# EasyEDA Pro project mousring.epro

# Schematic Schematic1
Board Name: Board1; Create Date: 2025-04-29; Page Name: P1; Project Name: mousering; Schematic Name: Schematic1; Update Date: 2025-05-12; Company: EasyEDA.com; Page Size: A4; Version: V1.0
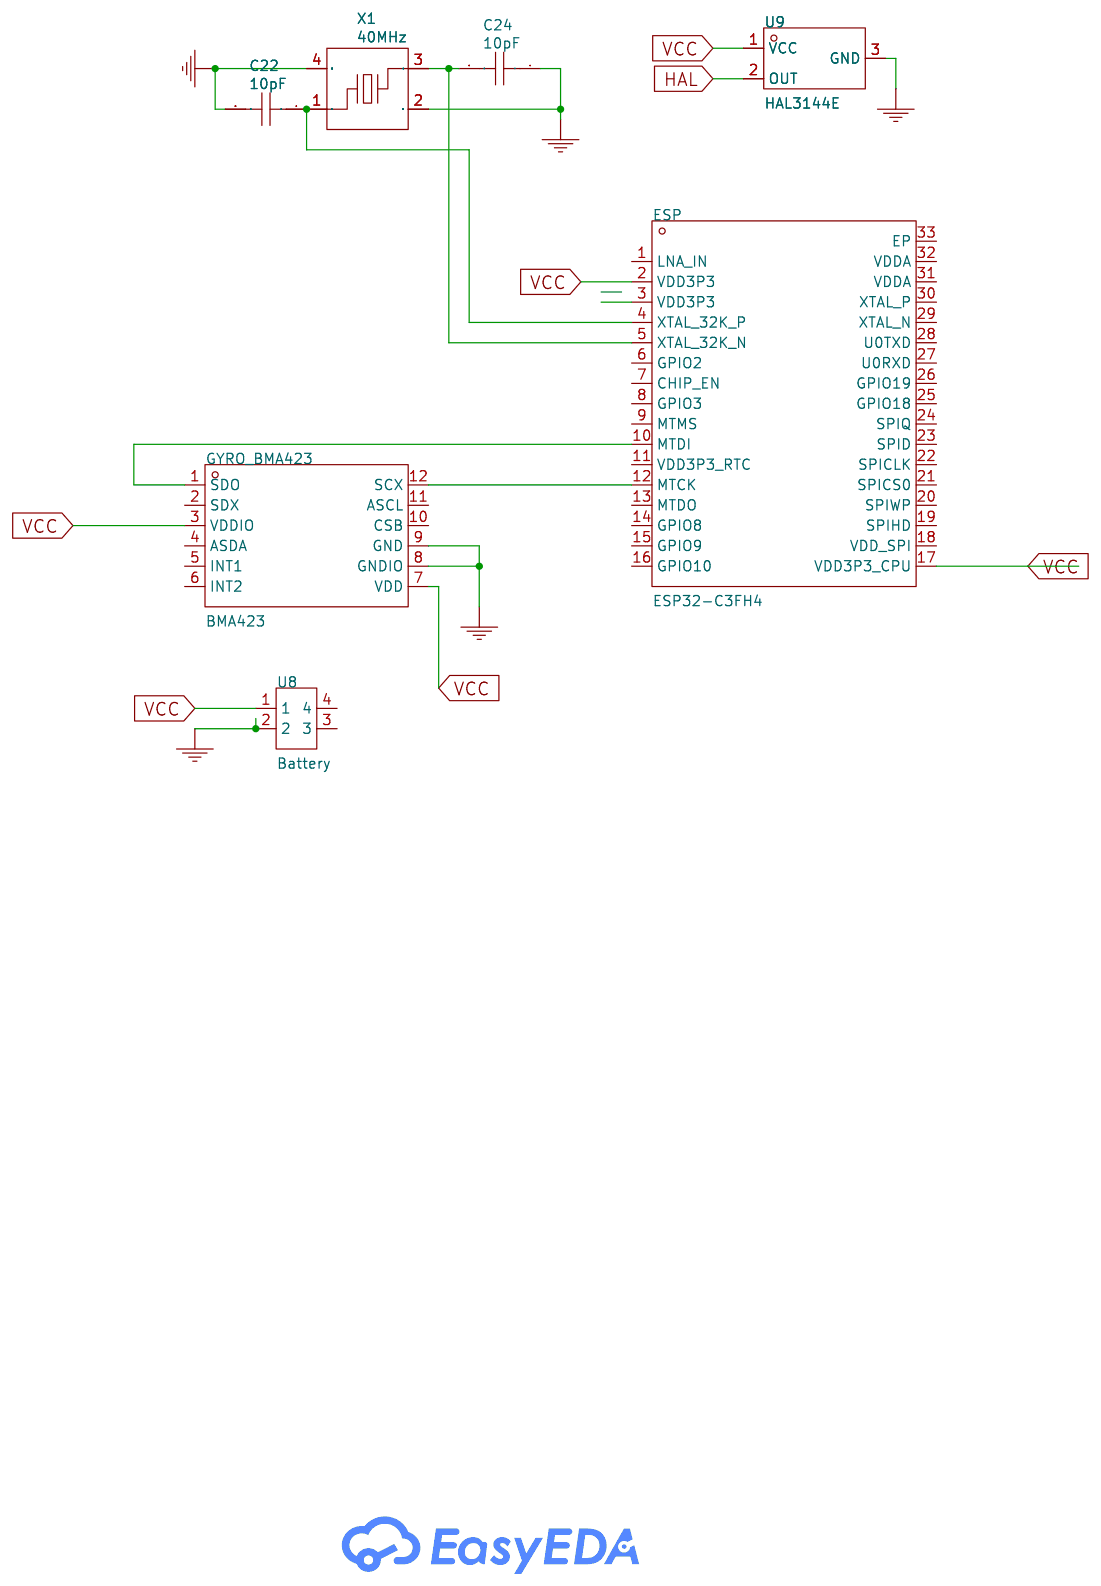
[diagram p0: schematic sheet]

## Parts
C22  10pF  [C0402]
C24  10pF  [C0402]
ESP  ESP32-C3FH4  [QFN-32_L5.0-W5.0-P0.50-TL-EP3.7]
GYRO_BMA423  BMA423  [LGA-12_L2.0-W2.0-P0.50-BL]
U8  Battery  [CONN-SMD_2.0-2PWT]
U9  HAL3144E  [SOT-23-3_L2.9-W1.6-P1.90-LS2.9-BL]
X1  40MHz  [CRYSTAL-SMD_4P-L1.6-W1.2-BL]

## Library data of the parts
C22 C24 = 10pF: Supplier: LCSC; Manufacturer: SAMSUNG(三星); Manufacturer Part: CL05C100JB5NNNC; Supplier Part: C32949; JLCPCB Part Class: Basic Part; link: https://lcsc.com/eda_search?q=C32949&%26type=1&ref=editor; nameAlias: Value; spicePre: C; spiceSymbolName: CL05C100JB5NNNC
ESP = ESP32-C3FH4: Supplier Part: C2858491; Manufacturer: ESPRESSIF(乐鑫); Supplier Footprint: QFN-32-EP(5x5); JLCPCB Part Class: Extended Part; Datasheet: https://atta.szlcsc.com/upload/public/pdf/source/20241030/9E2CC81EADAF965BF8A3CB78FAC4244F.pdf; Supplier: LCSC
GYRO_BMA423 = BMA423: Supplier Part: C189517; Manufacturer: Bosch(博世); Supplier Footprint: LGA-12(2x2); JLCPCB Part Class: Extended Part; Datasheet: https://atta.szlcsc.com/upload/public/pdf/source/20180628/C189517_D4E5A05318518518FDA0E175D3C2B3DB.pdf; Supplier: LCSC
U8 = Battery: Supplier Part: C9900011133; JLCPCB Part Class: Extended Part; Supplier: LCSC
U9 = HAL3144E: Voltage - Supply:3.8V~40V Voltage - Supply:3.8V~40V Operation Points:160Gs Operation Points:160Gs Release Points:40Gs Release Points:40Gs Operating Temperature:-40℃~+150℃ Operating Temperature:-40℃~+150℃; Supplier Part: C2843419; Manufacturer: Hallwee(霍尔微电子); Supplier Footprint: SOT-23; JLCPCB Part Class: Extended Part; Datasheet: https://atta.szlcsc.com/upload/public/pdf/source/20230614/A78D6DD088F58E7DA53C0C3D5890D47D.pdf; Supplier: LCSC; Voltage - Supply: 3.8V~40V; Operation Points: 160Gs; Release Points: 40Gs; Operating Temperature: -40℃~+150℃
X1 = 40MHz: Supplier: LCSC; Supplier Part: C7301927; Manufacturer: SCTF(星通时频); Manufacturer Part: SX0B40.000F1010F30; JLCPCB Part Class: Extended Part; nameAlias: Value; Contributor: lcsc; spicePre: X; spiceSymbolName: SX0B40.000F1010F30

## Nets
GND: C22.2 C24.1 GYRO_BMA423.8(GNDIO) GYRO_BMA423.9(GND) U8.2 U9.3(GND) X1.2(GND) X1.4(GND)
VCC: ESP.2(VDD3P3) ESP.17(VDD3P3_CPU) GYRO_BMA423.3(VDDIO) GYRO_BMA423.7(VDD) U8.1 U9.1(VCC)
HAL: U9.2(OUT)
$1N3840: ESP.10(MTDI) GYRO_BMA423.1(SDO)
$1N3967: C24.2 ESP.5(XTAL_32K_N) X1.3
$1N3968: C22.1 ESP.4(XTAL_32K_P) X1.1
$1N4537: ESP.12(MTCK) GYRO_BMA423.12(SCX)

Not connected (* = marked no-connect by the designer): ESP 1(LNA_IN) 3(VDD3P3) 6(GPIO2) 7(CHIP_EN) 8(GPIO3) 9(MTMS) 11(VDD3P3_RTC) 13(MTDO) 14(GPIO8) 15(GPIO9) 16(GPIO10) 18(VDD_SPI) 19(SPIHD) 20(SPIWP) 21(SPICS0) 22(SPICLK) 23(SPID) 24(SPIQ) 25(GPIO18) 26(GPIO19) 27(U0RXD) 28(U0TXD) 29(XTAL_N) 30(XTAL_P) 31(VDDA) 32(VDDA) 33(EP); GYRO_BMA423 2(SDX) 4(ASDA) 5(INT1) 6(INT2) 10(CSB) 11(ASCL); U8 3 4

# Schematic Schematic1_1
Board Name: Board1; Create Date: 2025-04-29; Page Name: P1; Project Name: mousering; Schematic Name: Schematic1; Update Date: 2025-05-12; Company: EasyEDA.com; Page Size: A4; Version: V1.0
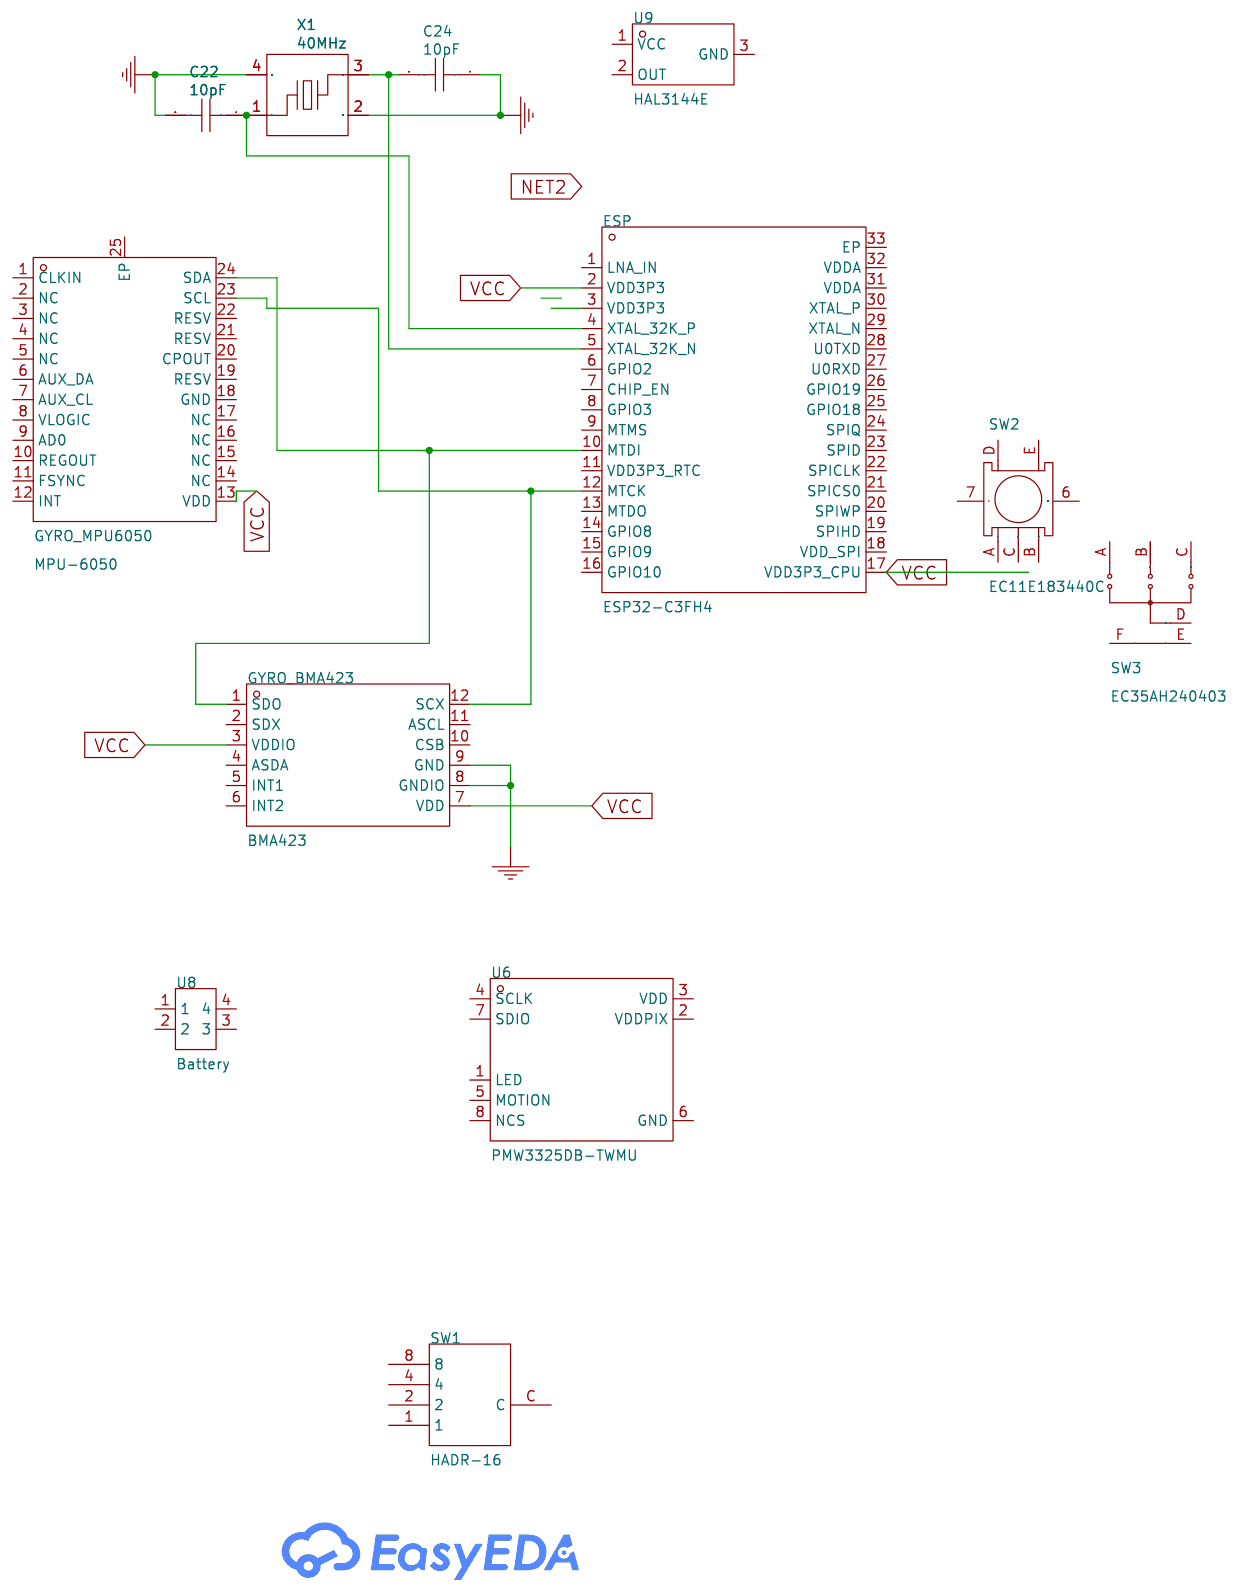
[diagram p1: schematic sheet]

## Parts
C22  10pF  [C0402]
C24  10pF  [C0402]
ESP  ESP32-C3FH4  [QFN-32_L5.0-W5.0-P0.50-TL-EP3.7]
GYRO_BMA423  BMA423  [LGA-12_L2.0-W2.0-P0.50-BL]
GYRO_MPU6050  MPU-6050  [QFN-24_L4.0-W4.0-P0.50-BL-EP2.7]
SW1  HADR-16  [SW-TH_5P-L10.0-W10.0-P2.54-LS7.6_HADR-16]
SW2  EC11E183440C  [SW-TH_EC11XXXXXXXX]
SW3  EC35AH240403  [SW-TH_EC35AH240403]
U6  PMW3325DB-TWMU  [SENSOR-TH_PAW3311DB-T2MU]
U8  Battery  [CONN-SMD_2.0-2PWT]
U9  HAL3144E  [SOT-23-3_L2.9-W1.6-P1.90-LS2.9-BL]
X1  40MHz  [CRYSTAL-SMD_4P-L1.6-W1.2-BL]

## Library data of the parts
C22 C24 = 10pF: Supplier: LCSC; Manufacturer: SAMSUNG(三星); Manufacturer Part: CL05C100JB5NNNC; Supplier Part: C32949; JLCPCB Part Class: Basic Part; link: https://lcsc.com/eda_search?q=C32949&%26type=1&ref=editor; nameAlias: Value; spicePre: C; spiceSymbolName: CL05C100JB5NNNC
ESP = ESP32-C3FH4: Supplier Part: C2858491; Manufacturer: ESPRESSIF(乐鑫); Supplier Footprint: QFN-32-EP(5x5); JLCPCB Part Class: Extended Part; Datasheet: https://atta.szlcsc.com/upload/public/pdf/source/20241030/9E2CC81EADAF965BF8A3CB78FAC4244F.pdf; Supplier: LCSC
GYRO_BMA423 = BMA423: Supplier Part: C189517; Manufacturer: Bosch(博世); Supplier Footprint: LGA-12(2x2); JLCPCB Part Class: Extended Part; Datasheet: https://atta.szlcsc.com/upload/public/pdf/source/20180628/C189517_D4E5A05318518518FDA0E175D3C2B3DB.pdf; Supplier: LCSC
GYRO_MPU6050 = MPU-6050: Sensor Type:加速度计陀螺仪 Operating Temperature:-40℃~+85℃ Operating Temperature:-40℃~+85℃; Supplier Part: C24112; Manufacturer: TDK InvenSense(应美盛); Supplier Footprint: QFN-24-EP(4x4); JLCPCB Part Class: Extended Part; Datasheet: https://atta.szlcsc.com/upload/public/pdf/source/20140425/1457707046159.pdf; Supplier: LCSC; Sensor Type: 加速度计陀螺仪; Operating Temperature: -40℃~+85℃
SW1 = HADR-16: LCSC Part Name: H系列 微型旋转编码开关 HADR-16; Supplier Part: C411262; Manufacturer: SUNGMUN(韩国星炆电子); JLCPCB Part Class: Extended Part; Datasheet: https://atta.szlcsc.com/upload/public/pdf/source/20190821/C411262_A0B46B5A71187555B76338994588A046.pdf; Supplier: LCSC
SW2 = EC11E183440C: LCSC Part Name: 编码器; Supplier Part: C370986; Manufacturer: ALPSALPINE(阿尔卑斯阿尔派); Supplier Footprint: 插件; JLCPCB Part Class: Extended Part; Datasheet: https://atta.szlcsc.com/upload/public/pdf/source/20190222/C370986_C8C40795CB70D1F06B68DAB6923041B4.pdf; Supplier: LCSC
SW3 = EC35AH240403: Supplier Part: C351240; Manufacturer: ALPSALPINE(阿尔卑斯阿尔派); Supplier Footprint: 插件; JLCPCB Part Class: Extended Part; Datasheet: https://atta.szlcsc.com/upload/public/pdf/source/20190114/C351240_CA77CA1636DCFF63B796F1B8F54D559C.pdf; Supplier: LCSC
U6 = PMW3325DB-TWMU: Supplier Part: C9900148276; Supplier Footprint: DIP; Supplier: LCSC
U8 = Battery: Supplier Part: C9900011133; JLCPCB Part Class: Extended Part; Supplier: LCSC
U9 = HAL3144E: Voltage - Supply:3.8V~40V Voltage - Supply:3.8V~40V Operation Points:160Gs Operation Points:160Gs Release Points:40Gs Release Points:40Gs Operating Temperature:-40℃~+150℃ Operating Temperature:-40℃~+150℃; Supplier Part: C2843419; Manufacturer: Hallwee(霍尔微电子); Supplier Footprint: SOT-23; JLCPCB Part Class: Extended Part; Datasheet: https://atta.szlcsc.com/upload/public/pdf/source/20230614/A78D6DD088F58E7DA53C0C3D5890D47D.pdf; Supplier: LCSC; Voltage - Supply: 3.8V~40V; Operation Points: 160Gs; Release Points: 40Gs; Operating Temperature: -40℃~+150℃
X1 = 40MHz: Supplier: LCSC; Supplier Part: C7301927; Manufacturer: SCTF(星通时频); Manufacturer Part: SX0B40.000F1010F30; JLCPCB Part Class: Extended Part; nameAlias: Value; Contributor: lcsc; spicePre: X; spiceSymbolName: SX0B40.000F1010F30

## Nets
GND: C22.2 C24.1 GYRO_BMA423.8(GNDIO) GYRO_BMA423.9(GND) X1.2(GND) X1.4(GND)
VCC: ESP.2(VDD3P3) ESP.17(VDD3P3_CPU) GYRO_BMA423.3(VDDIO) GYRO_BMA423.7(VDD) GYRO_MPU6050.13(VDD)
$1N3830: ESP.12(MTCK) GYRO_BMA423.12(SCX) GYRO_MPU6050.23(SCL)
$1N3840: ESP.10(MTDI) GYRO_BMA423.1(SDO) GYRO_MPU6050.24(SDA)
$1N3967: C24.2 ESP.5(XTAL_32K_N) X1.3
$1N3968: C22.1 ESP.4(XTAL_32K_P) X1.1

Not connected (* = marked no-connect by the designer): ESP 1(LNA_IN) 3(VDD3P3) 6(GPIO2) 7(CHIP_EN) 8(GPIO3) 9(MTMS) 11(VDD3P3_RTC) 13(MTDO) 14(GPIO8) 15(GPIO9) 16(GPIO10) 18(VDD_SPI) 19(SPIHD) 20(SPIWP) 21(SPICS0) 22(SPICLK) 23(SPID) 24(SPIQ) 25(GPIO18) 26(GPIO19) 27(U0RXD) 28(U0TXD) 29(XTAL_N) 30(XTAL_P) 31(VDDA) 32(VDDA) 33(EP); GYRO_BMA423 2(SDX) 4(ASDA) 5(INT1) 6(INT2) 10(CSB) 11(ASCL); GYRO_MPU6050 1(CLKIN) 2(NC) 3(NC) 4(NC) 5(NC) 6(AUX_DA) 7(AUX_CL) 8(VLOGIC) 9(AD0) 10(REGOUT) 11(FSYNC) 12(INT) 14(NC) 15(NC) 16(NC) 17(NC) 18(GND) 19(RESV) 20(CPOUT) 21(RESV) 22(RESV) 25(EP); SW1 1 2 4 8 C; SW2 6 7 A B C D E; SW3 A B C D E F; U6 1(LED) 2(VDDPIX) 3(VDD) 4(SCLK) 5(MOTION) 6(GND) 7(SDIO) 8(NCS); U8 1 2 3 4; U9 1(VCC) 2(OUT) 3(GND)

# Board PCB1
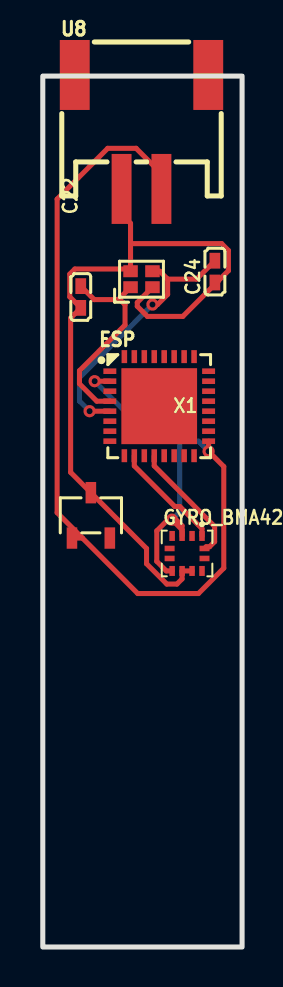
[diagram p2: board, top side]
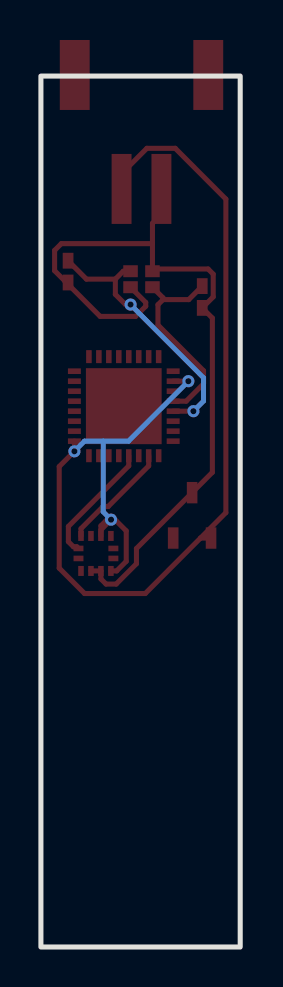
[diagram p3: board, bottom side, seen from below]

Outline 10 x 43.56 mm; copper layers: Top Layer, Bottom Layer. Coordinates in mm from the lower left corner of the outline.
Outline path: rectangle 0,43.56 10,0
Stack: Top Layer 0.035mm / Dielectric1 1.51mm FR4 er 4.5 / Bottom Layer 0.035mm

## Design rules (mm)
template: JLCPCB Capability(Two Layers Board)
spacing copperThickness1oz (default): track to track 0.102, other pairs 0.152 to 0.3
spacing copperThickness2oz: track to track 0.203, other pairs 0.152 to 0.3
track width copperThickness1oz (default): min 0.127, default 0.254, max 2.54
track width copperThickness2oz: min 0.203, default 0.254, max 2.54
differential pair differentialPair (default): width min 0.127, default 0.254, max 2.54; gap min 0.152, default 0.152
via viaSize (default): diameter min 0.5, default 0.61, max 10; hole min 0.3, default 0.305, max 6.3

## Placement (name value [footprint] x y rotation side)
C22  10pF  [C0402]  1.91 32.51 270 top
C24  10pF  [C0402]  8.64 33.78 90 top
ESP  ESP32-C3FH4  [QFN-32_L5.0-W5.0-P0.50-TL-EP3.7]  5.84 27.05 0 top
GYRO_BMA423  BMA423  [LGA-12_L2.0-W2.0-P0.50-BL]  7.24 19.69 180 top
U8  Battery  [CONN-SMD_2.0-2PWT]  4.95 40.77 0 top
U9  HAL3144E  [SOT-23-3_L2.9-W1.6-P1.90-LS2.9-BL]  2.41 21.59 0 top
X1  40MHz  [CRYSTAL-SMD_4P-L1.6-W1.2-BL]  4.95 33.4 0 top

## Footprints (pads in the part's own frame, mm; a bottom-side part is the same pattern mirrored in y, then rotated)
C0402
  rect 0.79x0.54 smd: 1(-0.545,0) 2(0.545,0)
CONN-SMD_2.0-2PWT
  rect 1x3.5 smd: 1(1,-2.85) 2(-1,-2.85)
  rect 1.5x3.5 smd: 3(3.35,2.85) 4(-3.35,2.85)
CRYSTAL-SMD_4P-L1.6-W1.2-BL
  rect 0.73x0.6 smd: 1(-0.55,-0.4) 2(0.55,-0.4) 3(0.55,0.4) 4(-0.55,0.4)
LGA-12_L2.0-W2.0-P0.50-BL
  rect 0.28x0.5 smd: 1(-0.75,-0.875) 2(-0.25,-0.875) 3(0.25,-0.875) 4(0.75,-0.875) 7(0.75,0.875) 8(0.25,0.875) 9(-0.25,0.875) 10(-0.75,0.875)
  rect 0.5x0.28 smd: 5(0.875,-0.25) 6(0.875,0.25) 11(-0.875,0.25) 12(-0.875,-0.25)
QFN-32_L5.0-W5.0-P0.50-TL-EP3.7
  rect 0.65x0.28 smd: 1(-2.478,1.75) 2(-2.478,1.25) 3(-2.478,0.75) 4(-2.478,0.25) 5(-2.478,-0.25) 6(-2.478,-0.75) 7(-2.478,-1.25) 8(-2.478,-1.75) 17(2.478,-1.75) 18(2.478,-1.25) 19(2.478,-0.75) 20(2.478,-0.25) 21(2.478,0.25) 22(2.478,0.75) 23(2.478,1.25) 24(2.478,1.75)
  rect 0.28x0.65 smd: 9(-1.75,-2.478) 10(-1.25,-2.478) 11(-0.75,-2.478) 12(-0.25,-2.478) 13(0.25,-2.478) 14(0.75,-2.478) 15(1.25,-2.478) 16(1.75,-2.478) 25(1.75,2.478) 26(1.25,2.478) 27(0.75,2.478) 28(0.25,2.478) 29(-0.25,2.478) 30(-0.75,2.478) 31(-1.25,2.478) 32(-1.75,2.478)
  rect 3.8x3.8 smd: 33(0,0)
SOT-23-3_L2.9-W1.6-P1.90-LS2.9-BL
  rect 0.532x1.07 smd: 1(-0.95,-1.135) 2(0.95,-1.135) 3(0,1.135)

## Nets
As in the schematic.

Pads without a net: ESP 1 6 7 8 9 11 13 14 15 16 18 19 20 21 22 23 24 25 26 27 28 29 30 31 32 33; GYRO_BMA423 2 4 5 6 10 11; U8 3 4

## Via types
v1: diameter 0.61, hole 0.305, Top Layer to Bottom Layer, 5 vias

## Routing (per net, layer and track width the routed paths; a pad name or vN(x,y) marks a point on that pad's centre or on a via; arc(x,y) is an arc through that point)
GND: length 40.4
  Top Layer w0.254: 4.4,35.18 4.4,36.2 3.95,36.65 U8.2 ; 4.4,35.18 4.4,33.91 ; 4.4,35.18 8.97,35.18 9.31,34.84 9.31,33.83 8.81,33.32 ; 4.4,33.91 X1.4 ; 4.4,33.91 1.61,33.91 1.35,33.66 1.35,32.52 C22.2 1.4,31.46 1.4,23.74 U9.3 5.21,19.93 5.21,19.17 6.22,18.15 6.73,18.15 6.99,18.41 GYRO_BMA423.8 GYRO_BMA423.9 ; C24.1 8.72,33.32 8.81,33.32 ; 8.81,33.32 7.03,31.54 5.25,31.54 4.74,32.05 4.74,32.24 X1.2
VCC: length 58.3
  Top Layer w0.254: 1.99,20.46 4.76,17.68 7.81,17.68 9.08,18.95 9.08,24.03 v1(8.32,24.79) ESP.17 ; 1.99,20.46 U9.1 ; 1.99,20.46 0.72,21.73 0.72,37.41 3.26,39.95 4.68,39.95 5.95,38.68 U8.1 ; 6.53,21.32 6.23,21.32 5.72,20.81 5.72,19.29 6.2,18.81 GYRO_BMA423.7 ; 6.53,21.32 v1(6.48,21.37) ; 6.53,21.32 6.74,21.32 6.99,21.07 6.99,20.87 ; 6.53,21.32 6.99,20.87 ; 6.99,20.87 GYRO_BMA423.3 ; ESP.2 v1(2.6,28.3)
  Bottom Layer w0.254: v1(8.32,24.79) 7.81,25.3 6.87,25.3 ; v1(6.48,21.37) 6.87,21.77 6.87,25.3 ; 6.87,25.3 5.6,25.3 v1(2.6,28.3)
$1N3840: length 5.6
  Top Layer w0.254: ESP.10 4.59,24.07 6.62,22.03 6.88,22.03 7.99,20.92 GYRO_BMA423.1
$1N3967: length 13.5
  Top Layer w0.254: C24.2 7.71,33.41 6.26,33.41 ; 6.26,33.41 6.26,32.64 5.76,32.14 v1(5.5,32.14) ; 6.26,33.41 5.87,33.8 X1.3 ; ESP.5 v1(2.35,26.8)
  Bottom Layer w0.254: v1(5.5,32.14) 1.84,28.47 1.84,27.31 v1(2.35,26.8)
$1N3968: length 10.2
  Top Layer w0.254: 3.87,32.38 4.13,32.13 4.13,31.11 1.84,28.83 1.84,28.17 2.71,27.3 ESP.4 ; 3.87,32.38 3.87,32.47 X1.1 ; 3.87,32.38 2.58,32.38 C22.1
$1N4537: length 6.2
  Top Layer w0.254: GYRO_BMA423.12 8.2,20.02 8.37,20.02 8.62,20.27 8.62,21.04 5.59,24.07 ESP.12

# Board PCB1_1
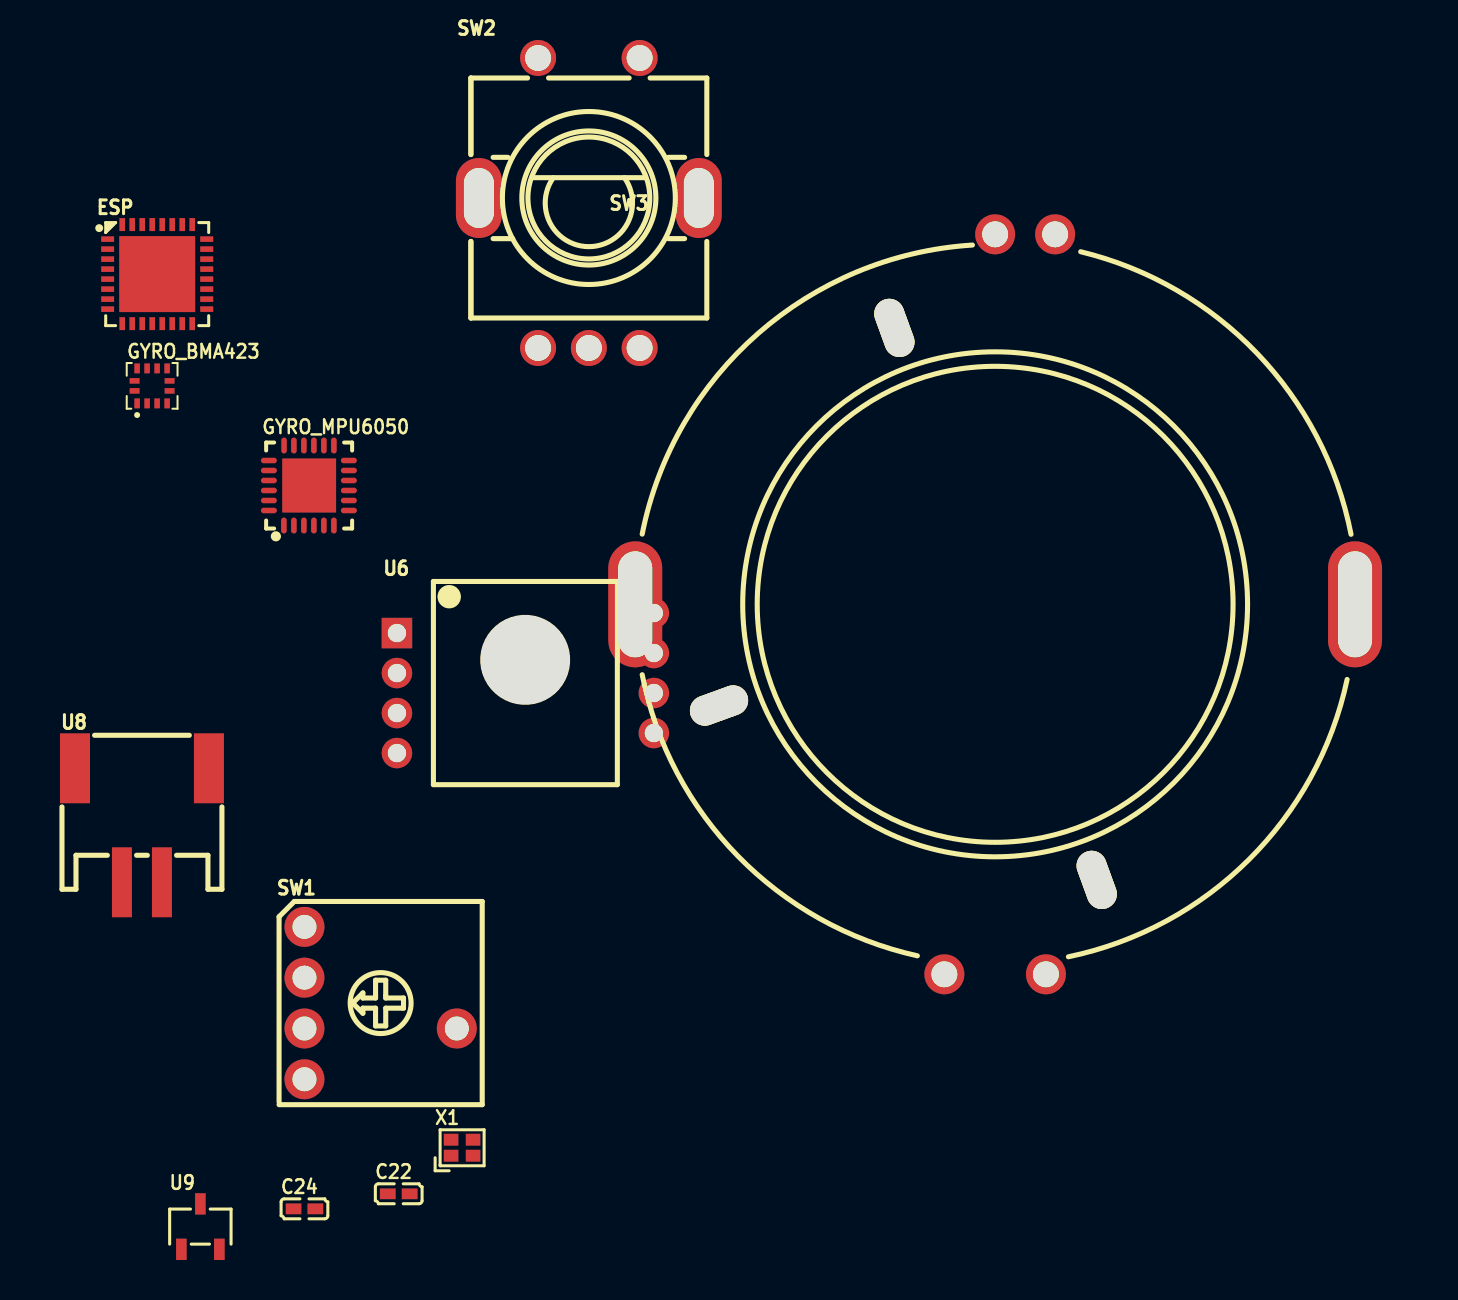
[diagram p4: board, top side]
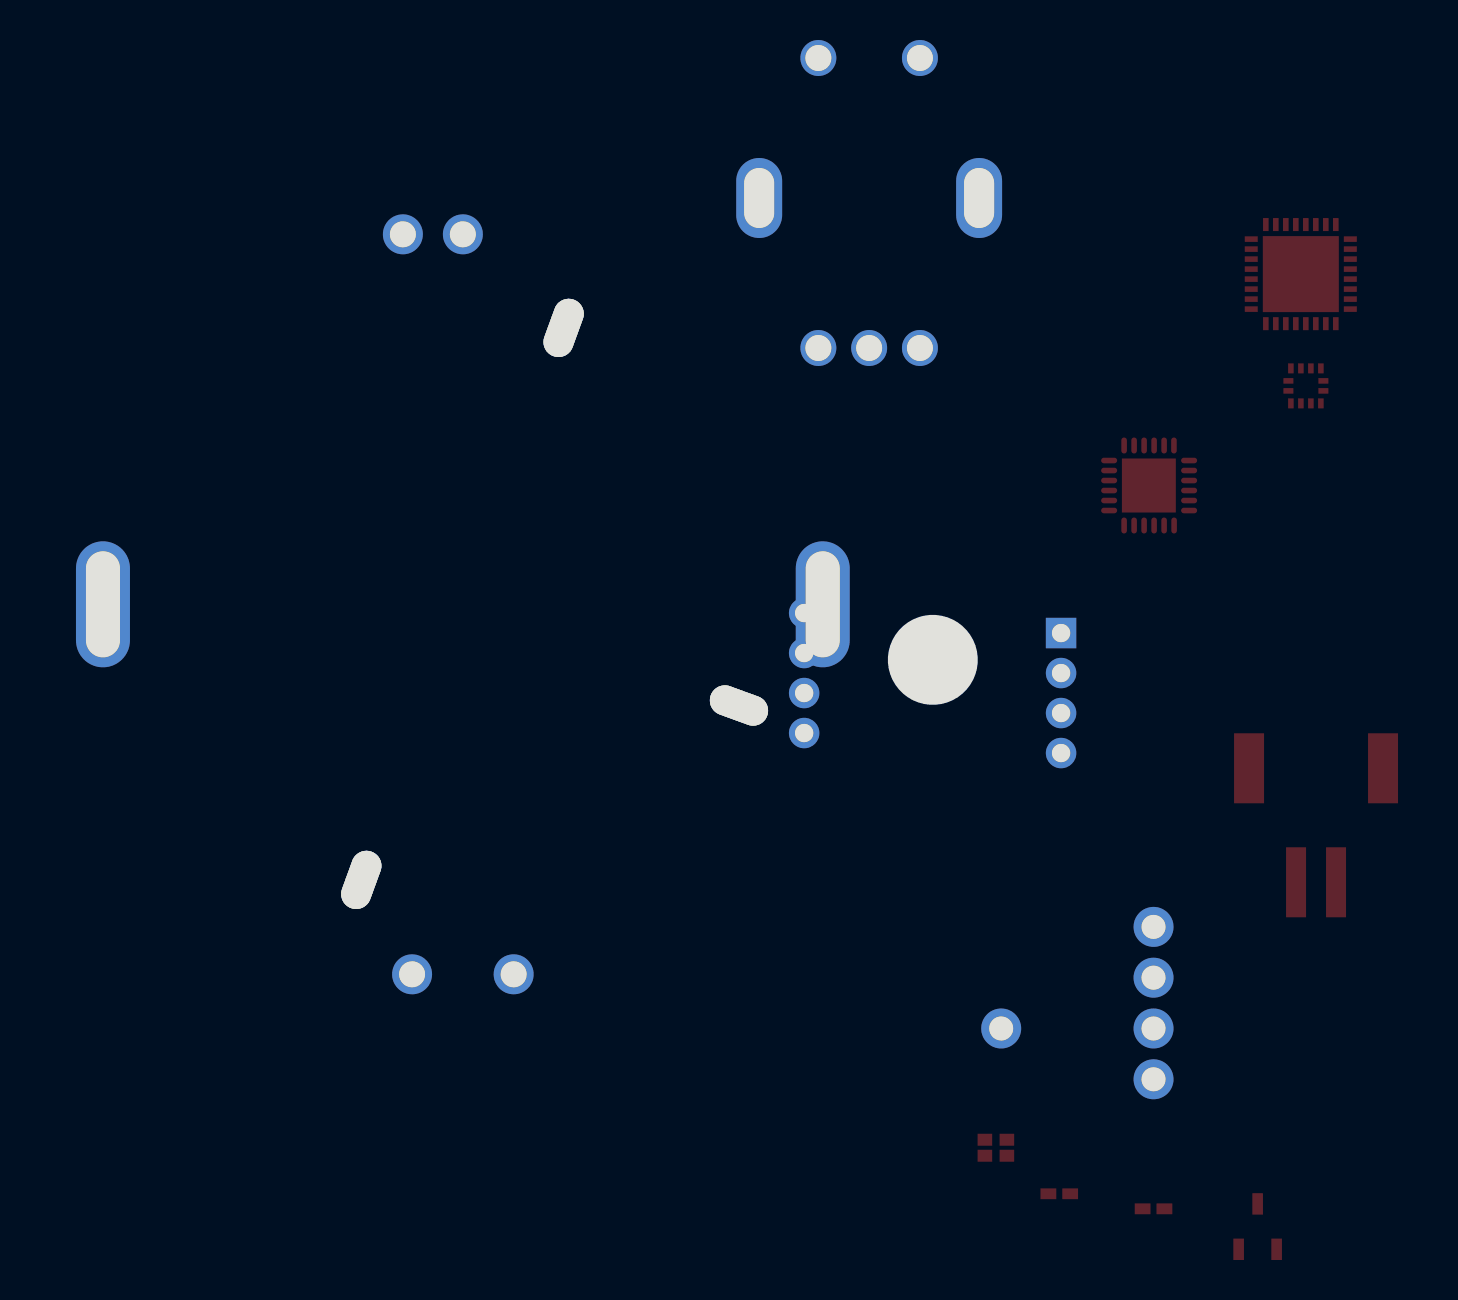
[diagram p5: board, bottom side, seen from below]

Outline 4.49 x 4.49 mm; copper layers: Top Layer, Bottom Layer. Coordinates in mm from the lower left corner of the outline.
Stack: Top Layer 0.035mm / Dielectric1 1.51mm FR4 er 4.5 / Bottom Layer 0.035mm

## Design rules (mm)
template: JLCPCB Capability(Two Layers Board)
spacing copperThickness1oz (default): track to track 0.102, other pairs 0.152 to 0.3
spacing copperThickness2oz: track to track 0.203, other pairs 0.152 to 0.3
track width copperThickness1oz (default): min 0.127, default 0.254, max 2.54
track width copperThickness2oz: min 0.203, default 0.254, max 2.54
differential pair differentialPair (default): width min 0.127, default 0.254, max 2.54; gap min 0.152, default 0.152
via viaSize (default): diameter min 0.5, default 0.61, max 10; hole min 0.3, default 0.305, max 6.3

## Placement (name value [footprint] x y rotation side)
C22  10pF  [C0402]  -4.08 -24.45 0 top
C24  10pF  [C0402]  -8.79 -25.2 0 top
ESP  ESP32-C3FH4  [QFN-32_L5.0-W5.0-P0.50-TL-EP3.7]  -16.16 21.53 0 top
GYRO_BMA423  BMA423  [LGA-12_L2.0-W2.0-P0.50-BL]  -16.41 15.94 0 top
GYRO_MPU6050  MPU-6050  [QFN-24_L4.0-W4.0-P0.50-BL-EP2.7]  -8.57 10.96 0 top
SW1  HADR-16  [SW-TH_5P-L10.0-W10.0-P2.54-LS7.6_HADR-16]  -4.98 -14.92 0 top
SW2  EC11E183440C  [SW-TH_EC11XXXXXXXX]  5.43 25.09 0 top
SW3  EC35AH240403  [SW-TH_EC35AH240403]  25.75 5.02 0 top
U6  PMW3325DB-TWMU  [SENSOR-TH_PAW3311DB-T2MU]  2.26 1.09 0 top
U8  Battery  [CONN-SMD_2.0-2PWT]  -16.92 -6.03 0 top
U9  HAL3144E  [SOT-23-3_L2.9-W1.6-P1.90-LS2.9-BL]  -14 -26.09 0 top
X1  40MHz  [CRYSTAL-SMD_4P-L1.6-W1.2-BL]  -0.91 -22.15 0 top

## Footprints (pads in the part's own frame, mm; a bottom-side part is the same pattern mirrored in y, then rotated)
C0402
  rect 0.79x0.54 smd: 1(-0.545,0) 2(0.545,0)
CONN-SMD_2.0-2PWT
  rect 1x3.5 smd: 1(1,-2.85) 2(-1,-2.85)
  rect 1.5x3.5 smd: 3(3.35,2.85) 4(-3.35,2.85)
CRYSTAL-SMD_4P-L1.6-W1.2-BL
  rect 0.73x0.6 smd: 1(-0.55,-0.4) 2(0.55,-0.4) 3(0.55,0.4) 4(-0.55,0.4)
LGA-12_L2.0-W2.0-P0.50-BL
  rect 0.28x0.5 smd: 1(-0.75,-0.875) 2(-0.25,-0.875) 3(0.25,-0.875) 4(0.75,-0.875) 7(0.75,0.875) 8(0.25,0.875) 9(-0.25,0.875) 10(-0.75,0.875)
  rect 0.5x0.28 smd: 5(0.875,-0.25) 6(0.875,0.25) 11(-0.875,0.25) 12(-0.875,-0.25)
QFN-24_L4.0-W4.0-P0.50-BL-EP2.7
  oval 0.28x0.8 smd: 1(-1.25,-2) 2(-0.75,-2) 3(-0.25,-2) 4(0.25,-2) 5(0.75,-2) 6(1.25,-2) 13(1.25,2) 14(0.75,2) 15(0.25,2) 16(-0.25,2) 17(-0.75,2) 18(-1.242,2)
  oval 0.8x0.28 smd: 7(2,-1.25) 8(2,-0.75) 9(2,-0.25) 10(2,0.25) 11(2,0.75) 12(2,1.25) 19(-2,1.25) 20(-2,0.75) 21(-2,0.25) 22(-2,-0.25) 23(-2,-0.75) 24(-2,-1.25)
  rect 2.7x2.7 smd: 25(0.013,0)
QFN-32_L5.0-W5.0-P0.50-TL-EP3.7
  rect 0.65x0.28 smd: 1(-2.478,1.75) 2(-2.478,1.25) 3(-2.478,0.75) 4(-2.478,0.25) 5(-2.478,-0.25) 6(-2.478,-0.75) 7(-2.478,-1.25) 8(-2.478,-1.75) 17(2.478,-1.75) 18(2.478,-1.25) 19(2.478,-0.75) 20(2.478,-0.25) 21(2.478,0.25) 22(2.478,0.75) 23(2.478,1.25) 24(2.478,1.75)
  rect 0.28x0.65 smd: 9(-1.75,-2.478) 10(-1.25,-2.478) 11(-0.75,-2.478) 12(-0.25,-2.478) 13(0.25,-2.478) 14(0.75,-2.478) 15(1.25,-2.478) 16(1.75,-2.478) 25(1.75,2.478) 26(1.25,2.478) 27(0.75,2.478) 28(0.25,2.478) 29(-0.25,2.478) 30(-0.75,2.478) 31(-1.25,2.478) 32(-1.75,2.478)
  rect 3.8x3.8 smd: 33(0,0)
SENSOR-TH_PAW3311DB-T2MU
  rect 1.524x1.524 hole 0.914: 1(-6.425,2.5)
  round 1.524 hole 0.914: 2(-6.425,0.5) 3(-6.425,-1.5) 4(-6.425,-3.5) 5(6.425,-2.5) 6(6.425,-0.5) 7(6.425,1.5) 8(6.425,3.5)
SOT-23-3_L2.9-W1.6-P1.90-LS2.9-BL
  rect 0.532x1.07 smd: 1(-0.95,-1.135) 2(0.95,-1.135) 3(0,1.135)
SW-TH_5P-L10.0-W10.0-P2.54-LS7.6_HADR-16
  round 2 hole 1.2: 1(-3.81,-3.81) 2(-3.81,-1.27) 4(-3.81,1.27) 8(-3.81,3.81) C(3.81,-1.27)
SW-TH_EC11XXXXXXXX
  oval 2.3x4 hole 1.5x3: 6(5.5,0.25) 7(-5.5,0.25)
  round 1.8 hole 1.3: A(-2.54,-7.25) B(2.54,-7.25) C(0,-7.25) D(-2.54,7.25) E(2.54,7.25)
SW-TH_EC35AH240403
  oval 1.5x3 hole 1.5x3 rot 110: (-13.81,-5.06)
  oval 1.5x3 hole 1.5x3 rot 20: (-5.04,13.82) (5.08,-13.78)
  round 2 hole 1.3: A(-2.54,-18.5) B(2.54,-18.5) C(3,18.5) D(0,18.5)
  oval 2.7x6.3 hole 1.7x5.3: E(-18,0) F(18,0)

## Nets
As in the schematic.

Pads without a net: ESP 1 6 7 8 9 11 13 14 15 16 18 19 20 21 22 23 24 25 26 27 28 29 30 31 32 33; GYRO_BMA423 2 4 5 6 10 11; GYRO_MPU6050 1 2 3 4 5 6 7 8 9 10 11 12 14 15 16 17 18 19 20 21 22 25; SW1 1 2 4 8 C; SW2 6 7 A B C D E; SW3 A B C D E F; U6 1 2 3 4 5 6 7 8; U8 1 2 3 4; U9 1 2 3
